# Altium schematic sheet Sheet5 - Allegro.SchDoc
size A4
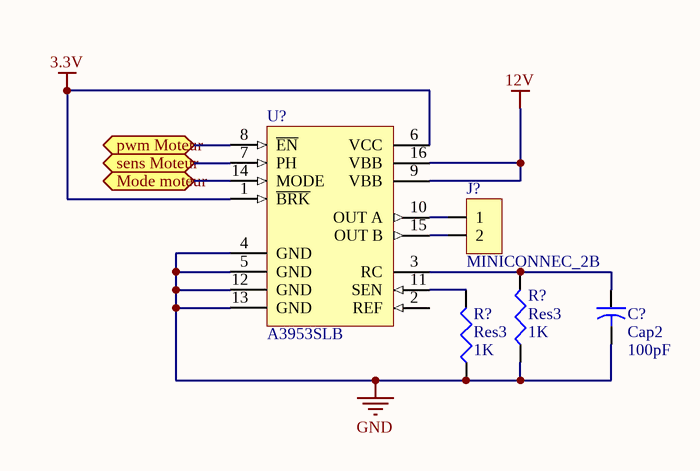
[diagram p0: Sheet5 - Allegro.SchDoc]

## Parts
(Parts that share a designator on the sheet are numbered #1, #2 ... from top to bottom, then left to right.)
C?  Cap2  value 100pF  [CAPR5-4X5]
J?  MINICONNEC_2B  [MINICONNEC_C]
R?#1  Res3  value 1K  [RESC1608L]
R?#2  Res3  value 1K  [RESC1608L]
U?  A3953SLB  [LB16_N]

## Ports
Mode moteur, pwm Moteur, sens Moteur

## Nets
3.3V: U?.1(~{BRK}) U?.6(VCC)
12V: U?.9(VBB) U?.16(VBB)
GND: C?.2 R?#1.1 R?#2.1 U?.4(GND) U?.5(GND) U?.12(GND) U?.13(GND)
Mode moteur: U?.14(MODE) ; port Mode moteur
pwm Moteur: U?.8(~{EN}) ; port pwm Moteur
sens Moteur: U?.7(PH) ; port sens Moteur
NetC?_1: C?.1 R?#1.2 U?.3(RC)
NetJ?_1: J?.1 U?.10(OUT_A)
NetJ?_2: J?.2 U?.15(OUT_B)
NetR?#2_2: R?#2.2 U?.11(SEN)

Not connected (* = marked no-connect by the designer): U? 2(REF)

## Library data of the parts
C? = Cap2: Capacitor; Published: 23-Sep-2002; PackageReference: CAPR5-4X5; Publisher: Altium Limited
J? = MINICONNEC_2B: Connecteur
R?#1 R?#2 = Res3: Resistor; Published: 8-Jun-2000; LatestRevisionDate: 29-May-2009; LatestRevisionNote: IPC-7351 Footprint Added.; PackageReference: J1-0603; Publisher: Altium Limited; PackageDescription: Chip Resistor
U? = A3953SLB: Full-Bridge PWM Motor Driver; Note: Pins (4,5) and (12,13) exist as TABS; all are internally connected (GND).; Published: 13-Oct-2000; LatestRevisionDate: 13-Apr-2006; LatestRevisionNote: IPC-7351 Footprint Added.; DatasheetVersion: 1995; PackageReference: LB16; Publisher: Altium Limited; PackageDescription: 16-Pin Small Outline Integrated Circuit 1.27 mm Pitch; Code_JEDEC: MS-013-AA; Code_IPC: SOIC127P1030-16; ComponentLink1Description: Manufacturer Link; ComponentLink1URL: http://www.allegromicro.com/; ComponentLink2Description: Datasheet; ComponentLink2URL: http://www.allegromicro.com/sf/3953/